# Altium schematic sheet LCDTFT_FPC40P_SPI4_4p0INCH_RTP.SchDoc
size A3; SheetNumber: 6; SheetTotal: 7
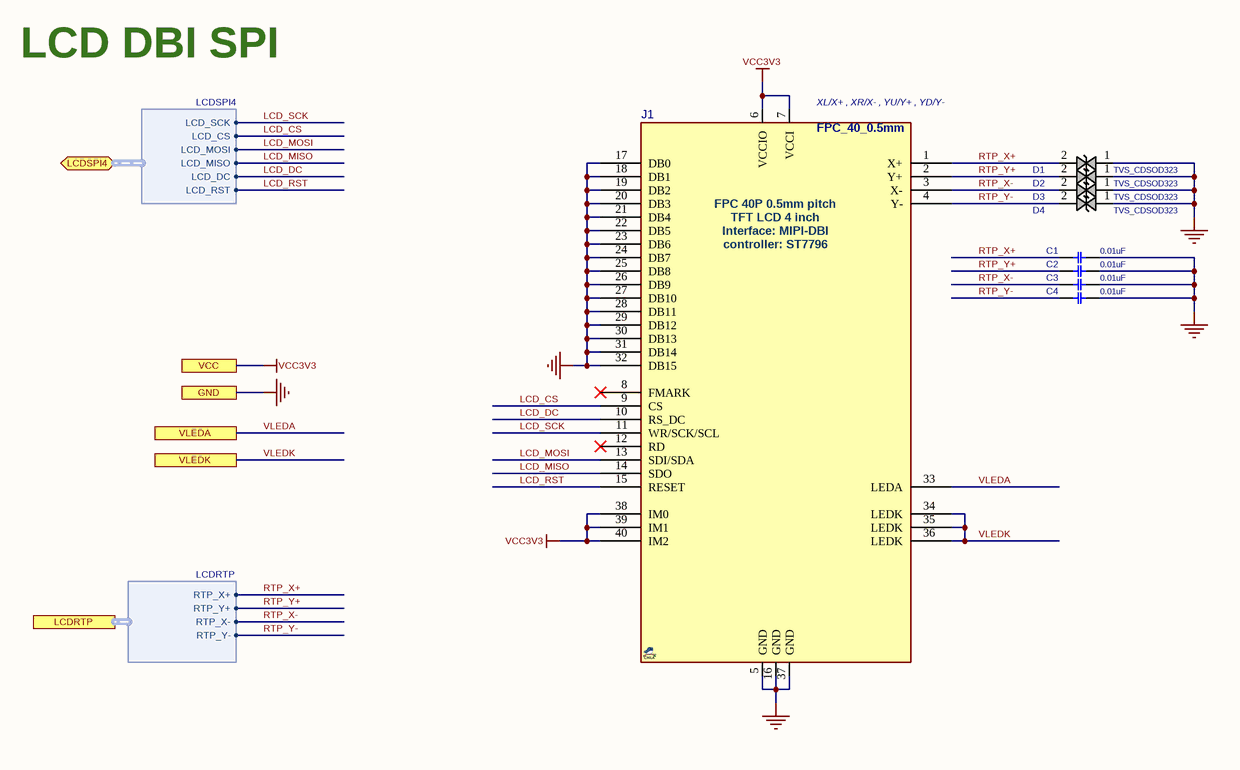
[diagram p0: LCDTFT_FPC40P_SPI4_4p0INCH_RTP.SchDoc]

## Parts
C1  0.01uF  [C0402]
C2  0.01uF  [C0402]
C3  0.01uF  [C0402]
C4  0.01uF  [C0402]
D1  TVS_CDSOD323  [D0805]
D2  TVS_CDSOD323  [D0805]
D3  TVS_CDSOD323  [D0805]
D4  TVS_CDSOD323  [D0805]
J1  FPC50_40  [FPC50_40T]  (value not drawn)

## Ports
GND, LCDRTP (harness LCDRTP), LCDSPI4 (bidir, harness LCDSPI4), VCC, VLEDA, VLEDK

## Harnesses
LCDSPI4: LCD_RST, LCD_MOSI, LCD_DC, LCD_SCK, LCD_CS, LCD_MISO
LCDRTP: RTP_X+, RTP_Y+, RTP_X-, RTP_Y-

## Nets
GND: C1.1 C2.1 C3.1 C4.1 D1.1 D2.1 D3.1 D4.1 J1.5(GND) J1.16(GND) J1.17(DB0) J1.18(DB1) J1.19(DB2) J1.20(DB3) J1.21(DB4) J1.22(DB5) J1.23(DB6) J1.24(DB7) J1.25(DB8) J1.26(DB9) J1.27(DB10) J1.28(DB11) J1.29(DB12) J1.30(DB13) J1.31(DB14) J1.32(DB15) J1.37(GND) ; port GND
VCC3V3: J1.6(VCCIO) J1.7(VCCI) J1.38(IM0) J1.39(IM1) J1.40(IM2) ; port VCC
LCD_CS: J1.9(CS) ; port LCDSPI4.LCD_CS
LCD_DC: J1.10(RS_DC) ; port LCDSPI4.LCD_DC
LCD_MISO: J1.14(SDO) ; port LCDSPI4.LCD_MISO
LCD_MOSI: J1.13(SDI/SDA) ; port LCDSPI4.LCD_MOSI
LCD_RST: J1.15(RESET) ; port LCDSPI4.LCD_RST
LCD_SCK: J1.11(WR/SCK/SCL) ; port LCDSPI4.LCD_SCK
RTP_X+: C1.2 D1.2 J1.1(X+) ; port LCDRTP.RTP_X+
RTP_X-: C3.2 D3.2 J1.3(X-) ; port LCDRTP.RTP_X-
RTP_Y+: C2.2 D2.2 J1.2(Y+) ; port LCDRTP.RTP_Y+
RTP_Y-: C4.2 D4.2 J1.4(Y-) ; port LCDRTP.RTP_Y-
VLEDA: J1.33(LEDA) ; port VLEDA
VLEDK: J1.34(LEDK) J1.35(LEDK) J1.36(LEDK) ; port VLEDK

Not connected (* = marked no-connect by the designer): J1 8(FMARK)* 12(RD)*

## Notes on the sheet
- LCD DBI SPI
- (near J1) XL/X+ , XR/X- , YU/Y+ , YD/Y-
- (in symbol LCDTFT_DBI_FPC40P_4INCH) FPC_40_0.5mm; FPC 40P 0.5mm pitch; TFT LCD 4 inch; Interface: MIPI-DBI; controller: ST7796

## Library data of the parts
C1-C4 = CAP_SMD_MLCC: CAP, MLCC; PARAM: X5R, 10%; PARAM2: 50v; PRICE: 50,000:	$0.006; MANF_P#: -; MANF: -; ASSEMBLY: ASSEMBLY; VALUE: 0.01uF
D1-D4 = TVS_CDSOD323: TVS, ESD PROTECT, Bidirectional; MANF_P#: CDSOD323-T12C; MANF: Bourns; PARAM2: 13.3VB, 12VR; PRICE: 0.7$; VALUE: TVS_CDSOD323
J1 = LCDTFT_DBI_FPC40P_4INCH: LCD TFT Color, FPC40P, 4" with touch; MANF: Hirose; MANF_P#: FH12A-40S-0.5SH; VALUE: FPC50_40